# Altium schematic sheet DetectorLogic.SchDoc
size A3
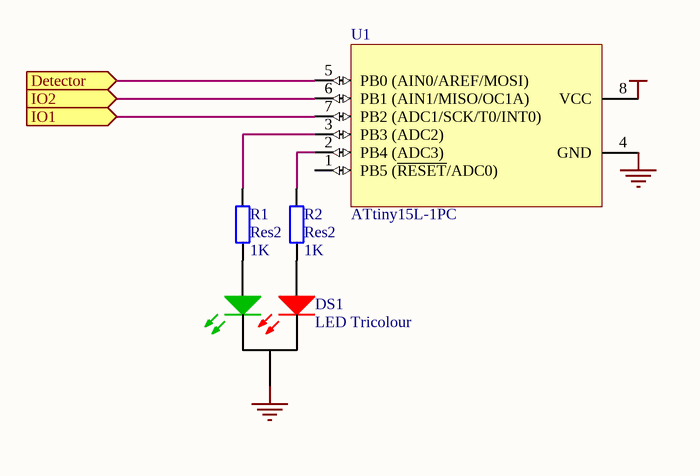
[diagram p0: DetectorLogic.SchDoc]

## Parts
DS1  LED Tricolour  [LED5mm TriColour]
R1  Res2  value 1K  [AXIAL-0.4]
R2  Res2  value 1K  [AXIAL-0.4]
U1  ATtiny15L-1PC  [8P3]

## Ports
Detector (in), IO1 (in), IO2 (in)

## Nets
GND: DS1.2(K) U1.4(GND)
VCC: U1.8(VCC)
Detector: U1.5(PB0_(AIN0/AREF/MOSI)) ; port Detector
IO1: U1.7(PB2_(ADC1/SCK/T0/INT0)) ; port IO1
IO2: U1.6(PB1_(AIN1/MISO/OC1A)) ; port IO2
NetDS1_1: DS1.1(Ag) R1.2
NetDS1_3: DS1.3(Ar) R2.2
NetR1_1: R1.1 U1.3(PB3_(ADC2))
NetR2_1: R2.1 U1.2(PB4_(ADC3))

Not connected (* = marked no-connect by the designer): U1 1(PB5_(~{RESET}/ADC0))

## Library data of the parts
DS1 = LED Tricolour: Typical Red Green Tri Color LED; Published: 8-Jun-2000; Revision: July-2002: Re-released for DXP Platform.; Publisher: Altium Limited
R1 R2 = Res2: Resistor; Published: 8-Jun-2000; Revision: July-2002: Re-released for DXP Platform.; Publisher: Altium Limited
U1 = ATtiny15L-1PC: 8-Bit AVR Microcontroller with 1K Byte of Flash Memory; Package Information: Latest Revision: revB, Sep-2001; Published: 17-Sep-2003; Datasheet: Latest Revision: 1187E-AVR-06/02; Package Reference: 8P3; Publisher: Altium Limited